# EasyEDA schematic SCH_Driver_Key_PCB_3.5_3.8_5.0_2022-07-11.json
TITLE: Sheet_1; REV: 1.0; Date: 2022-06-10; Sheet: 1/1; Company: Your Company
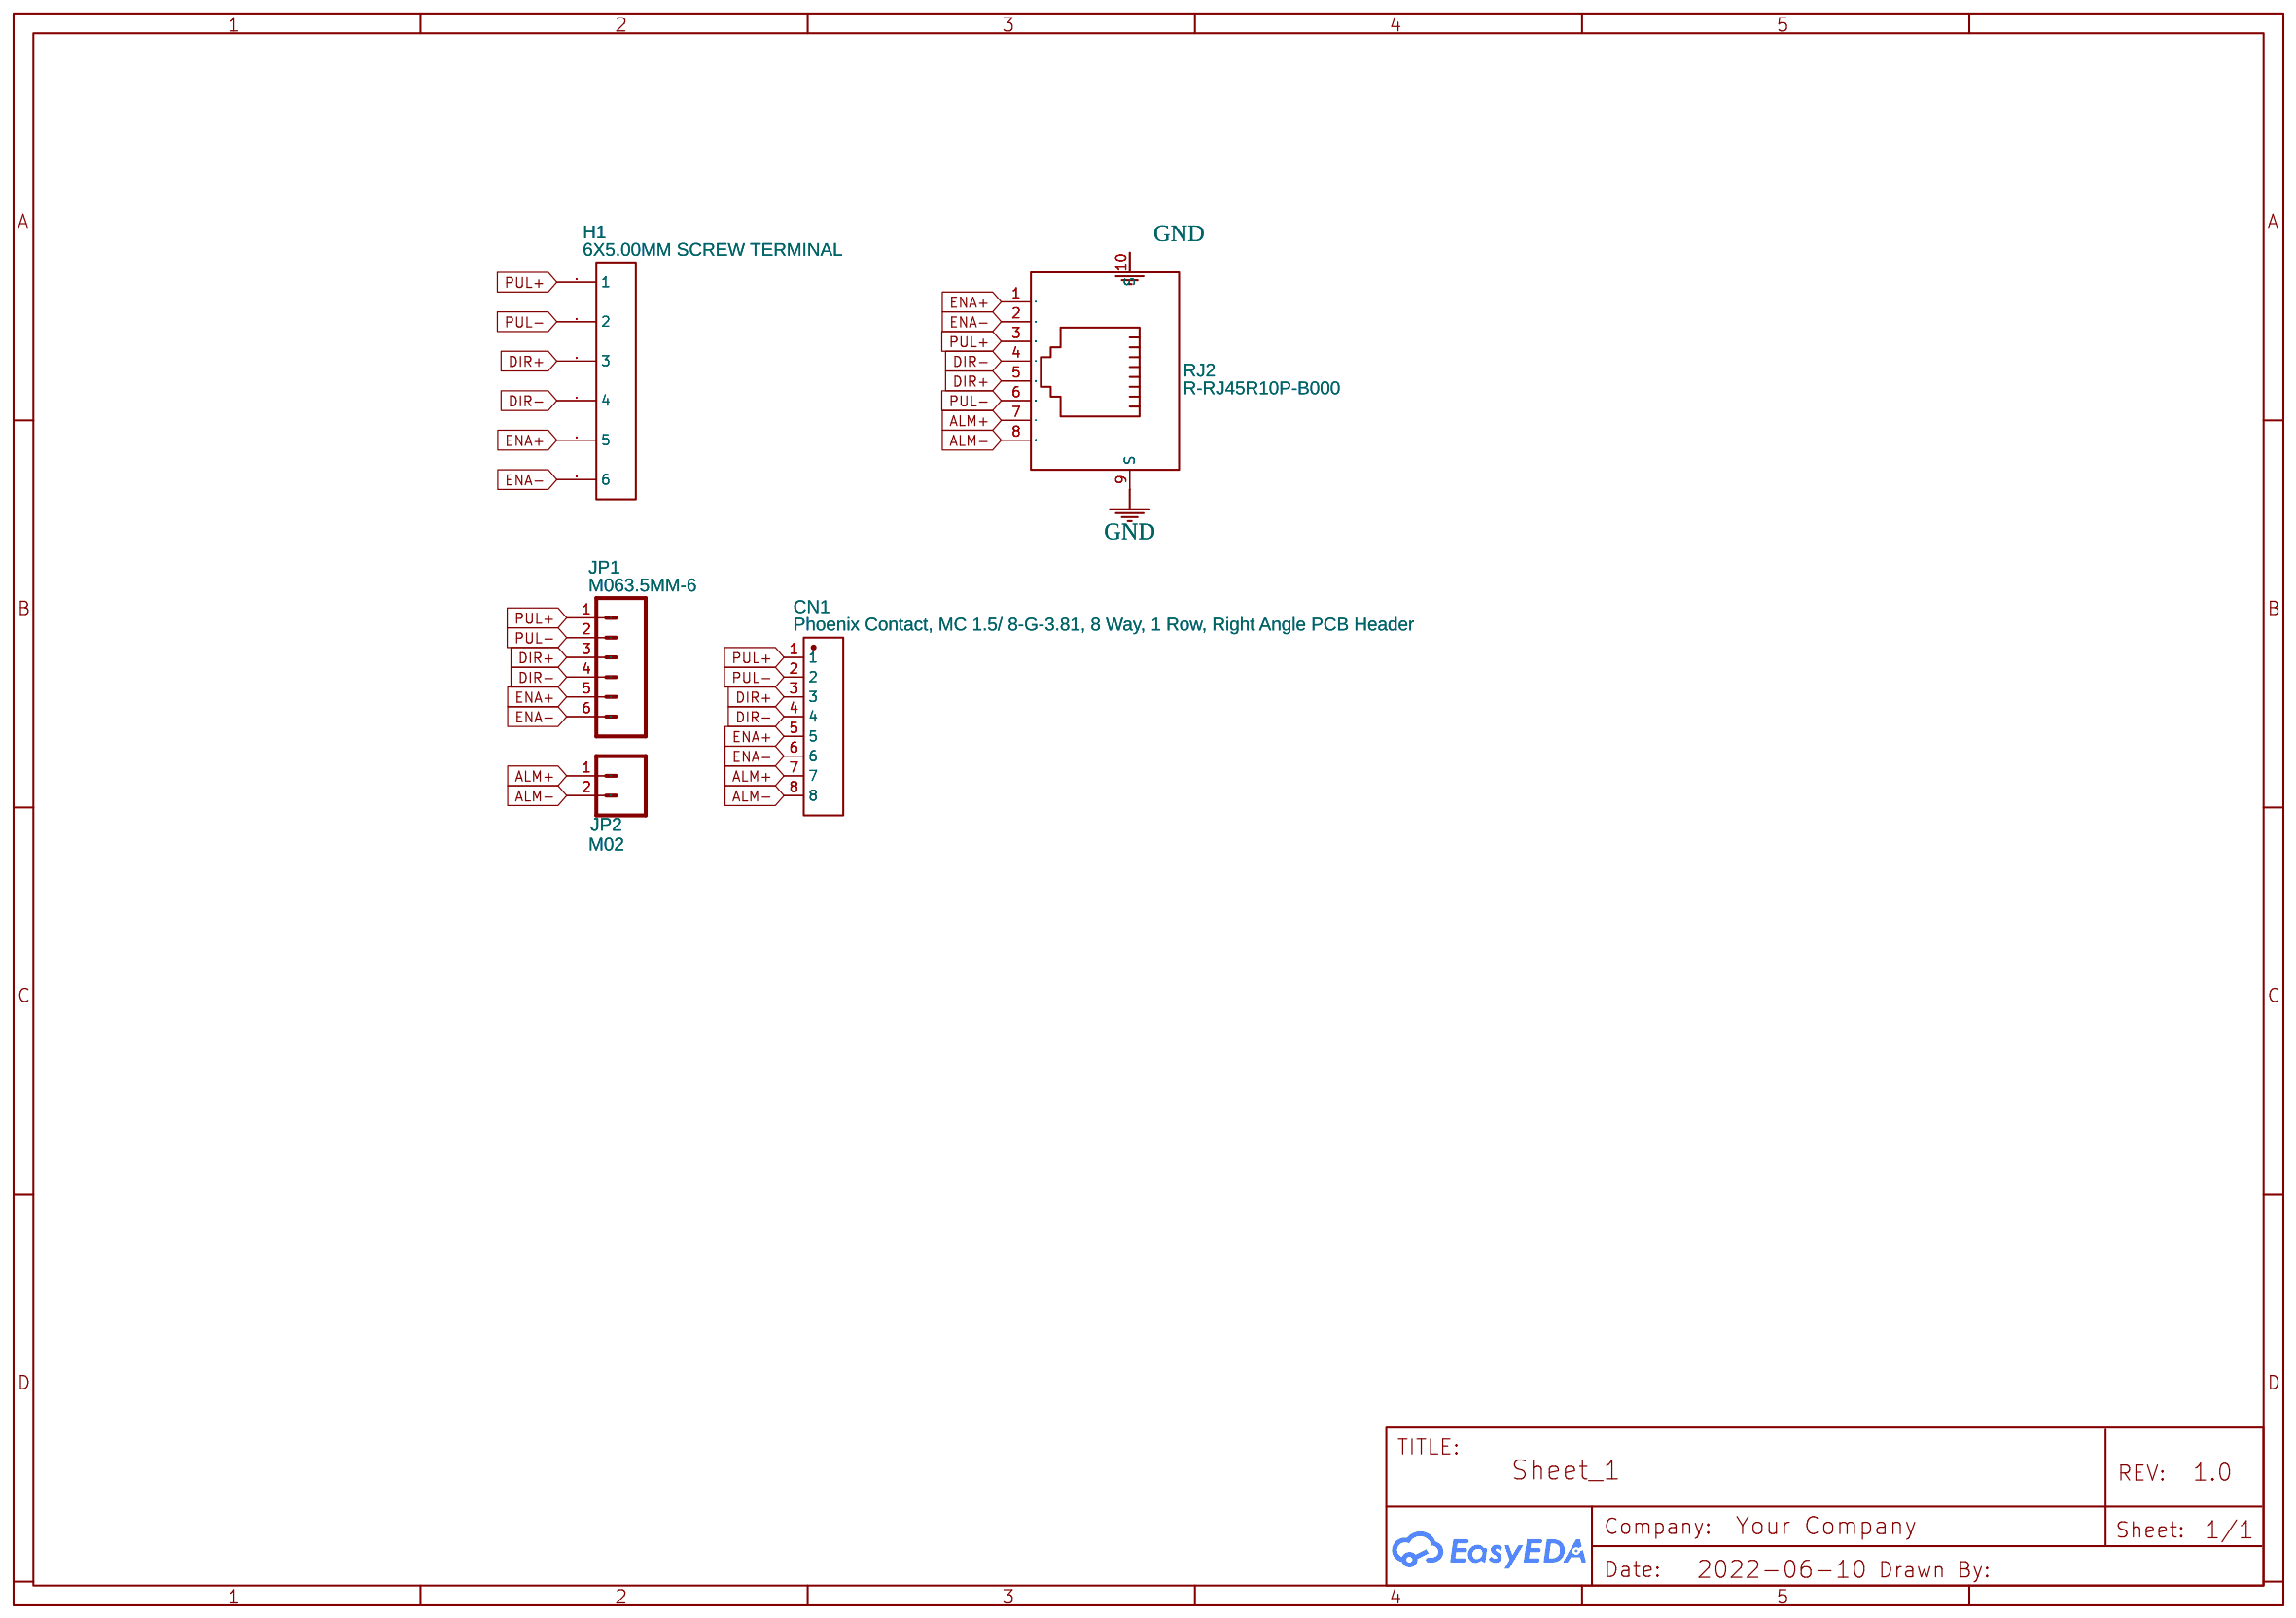
[diagram p0: schematic sheet]

## Parts
CN1  Phoenix Contact, MC 1.5/ 8-G-3.81, 8 Way, 1 Row, Right Angle PCB Header  [CONN-TH_1803484]
H1  6X5.00MM SCREW TERMINAL  [6X5.00MM SCREW TERMINAL]
JP1  M063.5MM-6  [SCREWTERMINAL-3.5MM-6]
JP2  M02  [SCREWTERMINAL-3.5MM-2]
RJ2  R-RJ45R10P-B000  [RJ45-TH_R-RJ45R10P-B000]

## Library data of the parts
CN1 = Phoenix Contact, MC 1.5/ 8-G-3.81, 8 Way, 1 Row, Right Angle PCB Header: Supplier: RS-Online; Supplier Part: 220-4793; Manufacturer: Phoenix Contact; Manufacturer Part: 1803332; Contributor: Glenny; JLCPCB Part Class: Extended Part
H1 = 6X5.00MM SCREW TERMINAL: Contributor: porkyneal
JP1 = M063.5MM-6: Header 6; Contributor: SparkFun
JP2 = M02: Contributor: SparkFun
RJ2 = R-RJ45R10P-B000: Supplier: LCSC; Supplier Part: C386758; Manufacturer: Shenzhen Cankemeng; Contributor: LCSC; JLCPCB Part Class: Extended Part

## Nets
GND: RJ2.9(S) RJ2.10(S)
ALM+: CN1.7 JP2.1 RJ2.7
ALM-: CN1.8 JP2.2 RJ2.8
DIR+: CN1.3 H1.3 JP1.3 RJ2.5
DIR-: CN1.4 H1.4 JP1.4 RJ2.4
ENA+: CN1.5 H1.5 JP1.5 RJ2.1
ENA-: CN1.6 H1.6 JP1.6 RJ2.2
PUL+: CN1.1 H1.1 JP1.1 RJ2.3
PUL-: CN1.2 H1.2 JP1.2 RJ2.6
